# EAGLE design Adafruit PCM5122 I2S DAC (EAGLE 9.6.2)
COMPANY: ADAFRUIT INDUSTRIES; DRAWN: KTOWN; REV: A; YEAR: 2017
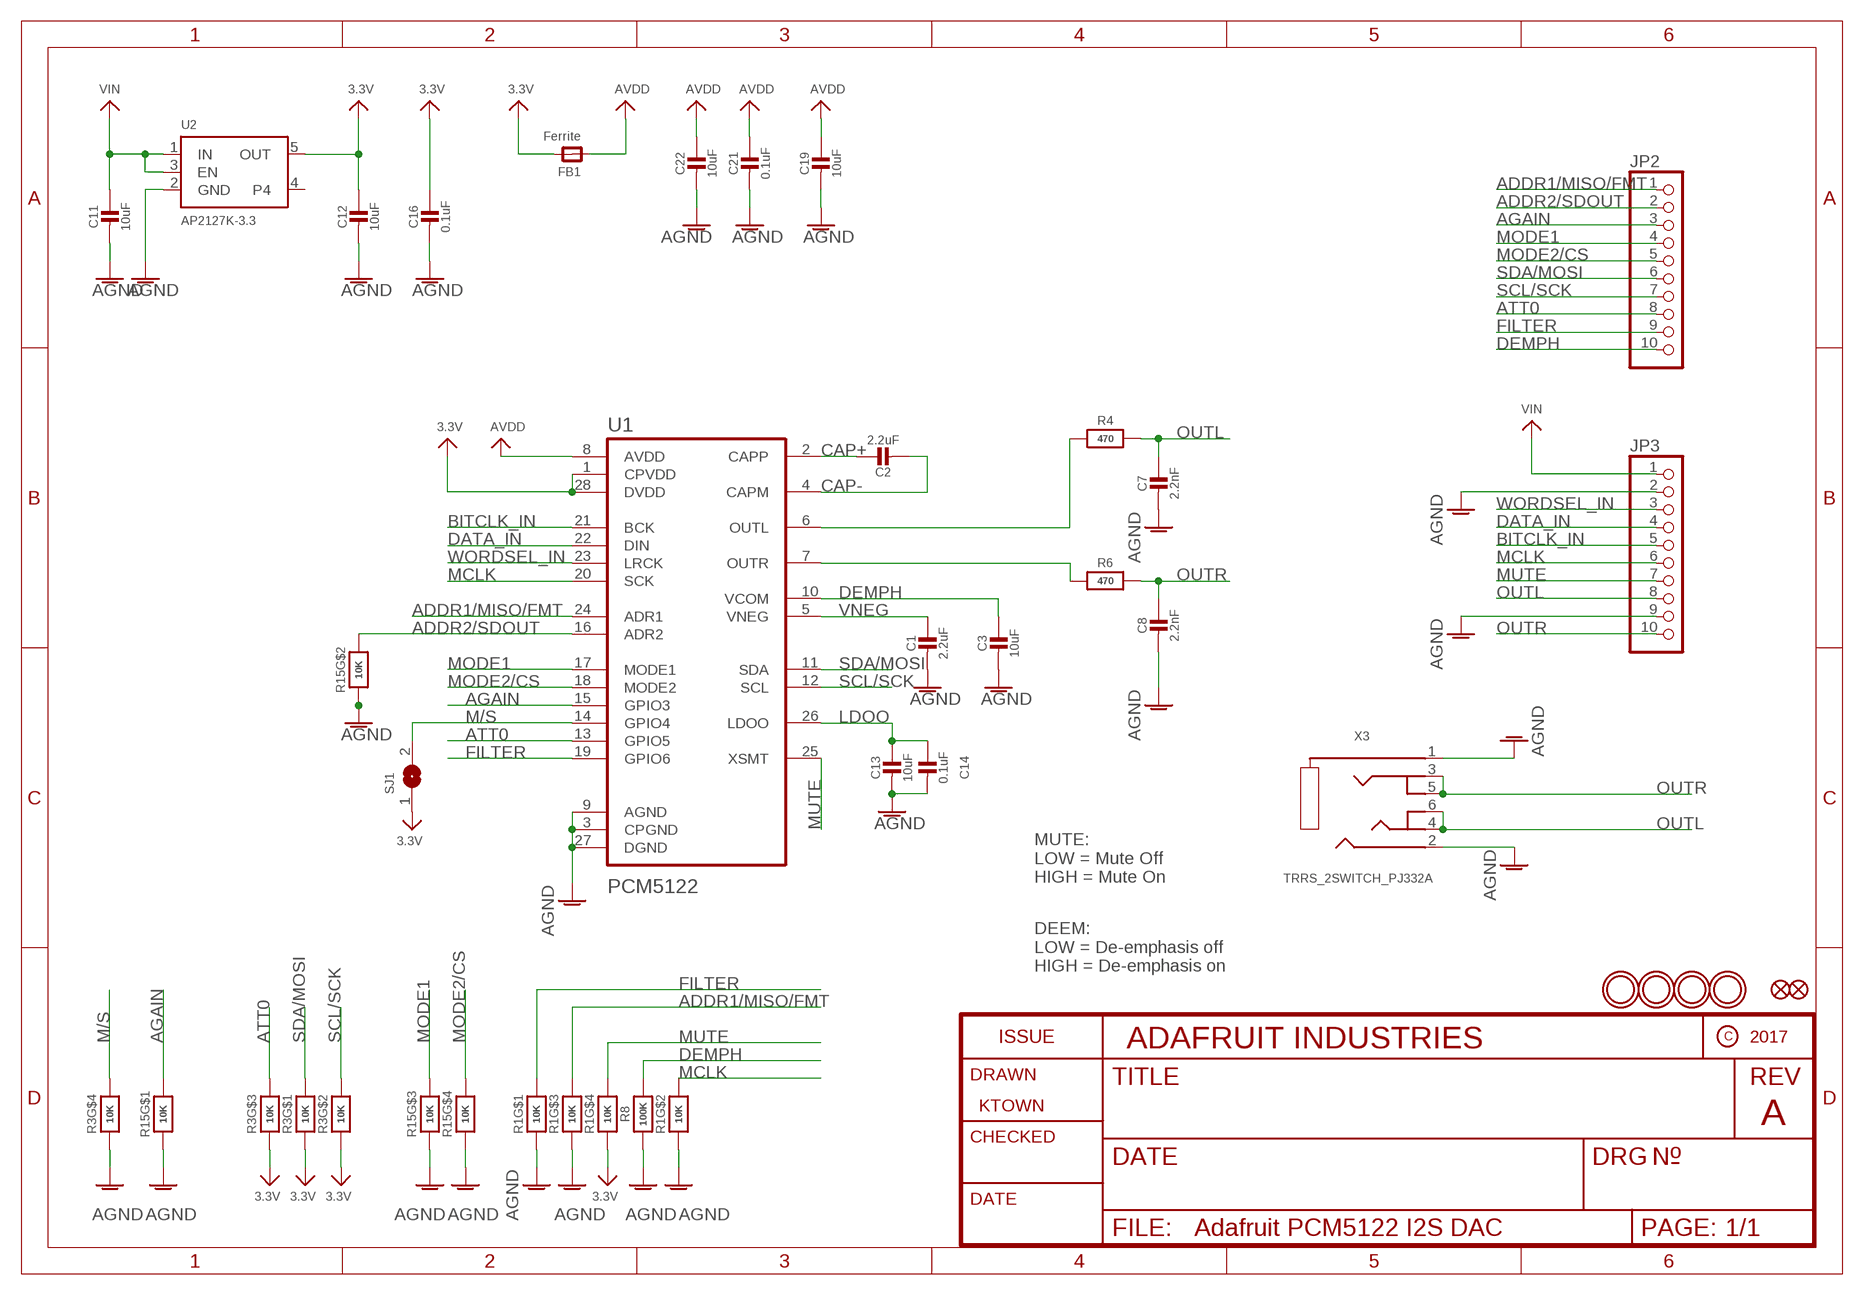
[diagram p0: schematic, sheet 1]

## Parts
C1  2.2uF  CAP_CERAMIC0603_NO  [0603-NO]
C2  2.2uF  CAP_CERAMIC0603_NO  [0603-NO]
C3  10uF  CAP_CERAMIC0805-NOOUTLINE  [0805-NO]
C7  2.2nF  CAP_CERAMIC0603_NO  [0603-NO]
C8  2.2nF  CAP_CERAMIC0603_NO  [0603-NO]
C11  10uF  CAP_CERAMIC0805-NOOUTLINE  [0805-NO]
C12  10uF  CAP_CERAMIC0805-NOOUTLINE  [0805-NO]
C13  10uF  CAP_CERAMIC0805-NOOUTLINE  [0805-NO]
C14  0.1uF  CAP_CERAMIC0603_NO  [0603-NO]
C16  0.1uF  CAP_CERAMIC0603_NO  [0603-NO]
C19  10uF  CAP_CERAMIC0805-NOOUTLINE  [0805-NO]
C21  0.1uF  CAP_CERAMIC0603_NO  [0603-NO]
C22  10uF  CAP_CERAMIC0805-NOOUTLINE  [0805-NO]
FB1  Ferrite  FERRITE-0603NO  [0603-NO]
FID1  FIDUCIAL_0.5MM  [FIDUCIAL_0.5MM]
FID2  FIDUCIAL_0.5MM  [FIDUCIAL_0.5MM]
JP2  HEADER-1X1070MIL  [1X10_ROUND70]
JP3  HEADER-1X1070MIL  [1X10_ROUND70]
R1  10K  RESISTOR_4PACK  [RESPACK_4X0603]
R3  10K  RESISTOR_4PACK  [RESPACK_4X0603]
R4  470  RESISTOR_0603_NOOUT  [0603-NO]
R6  470  RESISTOR_0603_NOOUT  [0603-NO]
R8  100K  RESISTOR_0603_NOOUT  [0603-NO]
R15  10K  RESISTOR_4PACK  [RESPACK_4X0603]
SJ1  SOLDERJUMPER  [SOLDERJUMPER_ARROW_NOPASTE]
U1  PCM5122  [SSOP-28N]
U2  AP2127K-3.3  VREG_SOT23-5  [SOT23-5]
U$11  MOUNTINGHOLE2.5  [MOUNTINGHOLE_2.5_PLATED]
U$12  MOUNTINGHOLE2.5  [MOUNTINGHOLE_2.5_PLATED]
U$13  MOUNTINGHOLE2.5  [MOUNTINGHOLE_2.5_PLATED]
U$14  MOUNTINGHOLE2.5  [MOUNTINGHOLE_2.5_PLATED]
X3  TRRS_2SWITCH_PJ332A  [PJ-332A]

## Nets
3.3V: C12.1 C16.1 FB1.2 R1.4 R3.1 R3.2 R3.3 SJ1.1 U1.1(CPVDD) U1.28(DVDD) U2.5(OUT)
ADDR1/MISO/FMT: JP2.1 R1.6 U1.24(ADR1)
ADDR2/SDOUT: JP2.2 R15.7 U1.16(ADR2)
AGAIN: JP2.3 R15.8 U1.15(GPIO3)
AGND: C1.2 C3.2 C7.2 C8.2 C11.2 C12.2 C13.2 C14.2 C16.2 C19.2 C21.2 C22.2 JP3.2 JP3.9 R1.1 R1.2 R1.3 R3.4 R8.1 R15.1 R15.2 R15.3 R15.4 U1.3(CPGND) U1.9(AGND) U1.27(DGND) U2.2(GND) X3.1(RING) X3.2(RING1)
ATT0: JP2.8 R3.6 U1.13(GPIO5)
AVDD: C19.1 C21.1 C22.1 FB1.1 U1.8(AVDD)
BITCLK_IN: JP3.5 U1.21(BCK)
CAP+: C2.1 U1.2(CAPP)
CAP-: C2.2 U1.4(CAPM)
DATA_IN: JP3.4 U1.22(DIN)
DEMPH: C3.1 JP2.10 R8.2 U1.10(VCOM)
FILTER: JP2.9 R1.8 U1.19(GPIO6)
LDOO: C13.1 C14.1 U1.26(LDOO)
M/S: R3.5 SJ1.2 U1.14(GPIO4)
MCLK: JP3.6 R1.7 U1.20(SCK)
MODE1: JP2.4 R15.6 U1.17(MODE1)
MODE2/CS: JP2.5 R15.5 U1.18(MODE2)
MUTE: JP3.7 R1.5 U1.25(XSMT)
N$1: R6.1 U1.7(OUTR)
N$2: R4.1 U1.6(OUTL)
OUTL: C7.1 JP3.8 R4.2 X3.4(TIP) X3.6(TIP_SW)
OUTR: C8.1 JP3.10 R6.2 X3.3(RING2) X3.5(R2_SW)
SCL/SCK: JP2.7 R3.7 U1.12(SCL)
SDA/MOSI: JP2.6 R3.8 U1.11(SDA)
VIN: C11.1 JP3.1 U2.1(IN) U2.3(EN)
VNEG: C1.1 U1.5(VNEG)
WORDSEL_IN: JP3.3 U1.23(LRCK)
Unconnected: U2.4

## Notes on the sheet
- MUTE:
  LOW = Mute Off
  HIGH = Mute On
- DEEM:
  LOW = De-emphasis off
  HIGH = De-emphasis on

## Library data of the parts
C1-C3 C7 C8 C11-C14 C16 C19 C21 C22 = microbuilder:CAP_CERAMIC: Ceramic Capacitors For new designs, use the packages preceded by an '_' character since they are more reliable: The following footprints should be used on most boards: _0402 - Standard footprint for regular board layouts _0603 - Standard footprint for regular board layouts _0805 - Standard footprint for regular board layouts _1206 - Standard footprint for regular board layouts For extremely tight-pitch boards where space is at a premium, the following 'micro-pitch' footprints can be used (smaller pads, no silkscreen outline, etc.): _0402MP - Micro-pitch footprint for very dense/compact boards _0603MP - Micro-pitch footprint for very dense/compact boards _0805MP - Micro-pitch footprint for very dense/compact boards _1206MP - Micro-pitch footprint for very dense/compact boards
FB1 = microbuilder:FERRITE: Ferrite Bead 0603 MMZ1608B121C - 120 Ohm @ 100MHz, 600mA, 0.15 Ohm DC Resistance - Digikey: 445-2164-1-ND BK1608HW121-T - 120 Ohm, 600mA Ferrite Chip - Digikey: 587-1876-2-ND 0805 HZ0805B272R-10 - 2.7K Ohm @ 100MHz, 200mA, 0.8 Ohm DC Resistance - Digikey: 240-2504-1-ND (see also Murata BLM21BD272SN1L) MMZ2012Y152B - 1.5K Ohm @ 100MHz, 500mA, 0.4 Ohm DC Resistance - Digikey: 445-1560-1-ND - Mainly for high frequency (80-400MHz) MMZ2012R102A - 1K Ohm @ 100MHz, 500mA, 0.3 Ohm DC Resistance - Digikey: 445-1555-2-ND - More general purpose (10-200MHz)
FID1 FID2 = microbuilder:FIDUCIAL: Fiducial Alignment Points Various fiducial points for machine vision alignment.
JP2 JP3 = microbuilder:HEADER-1X10: PIN HEADER
R1 R3 R15 = microbuilder:RESISTOR_4PACK: Resistor Packs (4 resistors) 4 x 0603 10K 1/16W - Digikey: YC164J-10KCT-ND
R4 R6 R8 = microbuilder:RESISTOR: Resistors For new designs, use the packages preceded by an '_' character since they are more reliable: The following footprints should be used on most boards: _0402 - Standard footprint for regular board layouts _0603 - Standard footprint for regular board layouts _0805 - Standard footprint for regular board layouts _1206 - Standard footprint for regular board layouts For extremely tight-pitch boards where space is at a premium, the following 'micro-pitch' footprints can be used (smaller pads, no silkscreen outline, etc.): _0402MP - Micro-pitch footprint for very dense/compact boards _0603MP - Micro-pitch footprint for very dense/compact boards _0805MP - Micro-pitch footprint for very dense/compact boards _1206MP - Micro-pitch footprint for very dense/compact boards
SJ1 = microbuilder:SOLDERJUMPER: SMD Solder JUMPER Solder the two pads together to create a connection, or remove the solder to break it. REFLOW - Use this footprint for solder paste and reflow ovens. WAVE - Use this footprint for hand-soldering (larger pads). CLOSED - Has a trace between the two pads to ensure it is closed by default. The trace needs to be cut to disable the jumper, and can be closed again by creating a solder bridge between the two pads.; BOM: EXCLUDE
U1 = microbuilder:PCM5122
U2 = adafruit_power:VREG_SOT23-5: SOT23-5 Fixed Voltage Regulators Part Current Out V Out V In V Dropout θJA (°C/W) TJ (°C) Digikey Part No. ADP121 150mA 3.3V 3.4-5.5V 0.09V @ 150mA -- -- ADP121-AUJZ33R7CT-ND ADP121 150mA 3.0V 3.1-5.5V 0.09V @ 150mA -- -- ADP121-AUJZ30R7CT-ND ADP122 300mA 3.3V 3.4-5.5V 0.085V @ 300mA -- -- ADP122AUJZ-3.3-R7CT-ND ADP1712 300mA 3.3V 3.5-5.5V 0.17V @ 300mA -- -- ADP1712AUJZ-3.3-R7TR-ND AP7311 (Low Cost) 150mA 3.3V 3.5-6V 0.15V @ 150mA -- -- AP7311-33WG-7DICT-ND LD39015M18R 150mA 1.8V 1.9V-5.5V 0.08V @ 100mA -- -- 497-6977-1-ND LP2985A-33DBVR 150mA 3.3V 3.3-16V 0.28V @ 150mA 206 150 296-18479-1-ND MCP1824T-3302E/OT 300mA 3.3V 3.5V-6V 0.2V @ 300mA -- -- MCP1824T-3302E/OTCT-ND MIC5205-2.5YM5 TR 150mA 2.5V 2.7-16V 0.165V @ 150mA -- -- 576-1257-2-ND MIC5205-3.0YM5 TR 150mA 3.0V 3.2V-16V 0.165V @ 150mA -- -- 576-1258-2-ND MIC5205-3.3YM5 TR 150mA 3.3V 3.5V-16V 0.165V @ 150mA -- -- 576-1259-2-ND TPS780330220 150mA 3.3V+2.2V 3.6-5.5V 250mV Max -- -- 296-23332-1-ND TDA3663/N1,135 100mA 3.3V 3.5-45V 0.18V @ 50mA -- -- 568-5343-1-ND Max operating temp can be calculated using θJA, TJ (max junction temperature), and power in watts. Set the "Maximum Ambient Temperature" until it reaches TJ ("Max Junction Temperature"), which is the absolute limit for safe use of the regulator: Heat Sink Temperature Calculator <http://www.daycounter.com/Calculators/Heat-Sink-Temperature-Calculator.phtml> For example, With 12V source into a 3.3V LP2985 and a 30mA load, we are dissipating (12V-3.3V) * 0.03A = 0.261W. With a θJA of 206 °C/W, a TJ of 150°C, and 261mW we can safely use the chip without a heat sink up to 75°C (=147.1°C Junction Temperature).; JLC_ROTATION: 270
U$11-U$14 = adafruit_electromech:MOUNTINGHOLE: Mounting Hole For #2 screws (0.086"/2.18mm width, 0.094"/2.4mm hole) use 2.5mm; BOM: EXCLUDE
X3 = adafruit_electromech:TRRS_2SWITCH

## Board
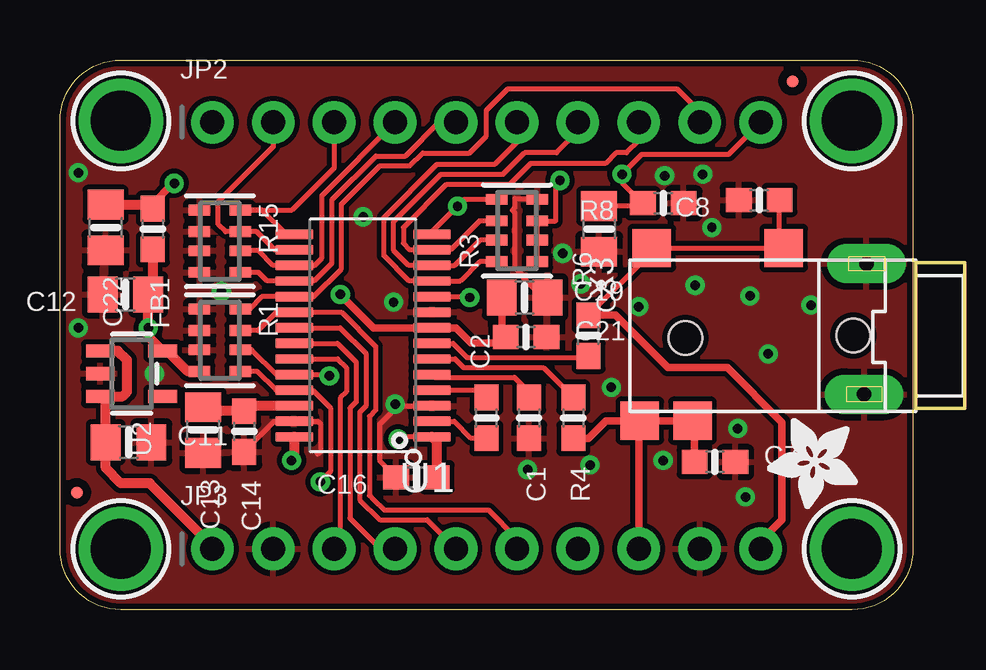
[diagram p1: board, top side]
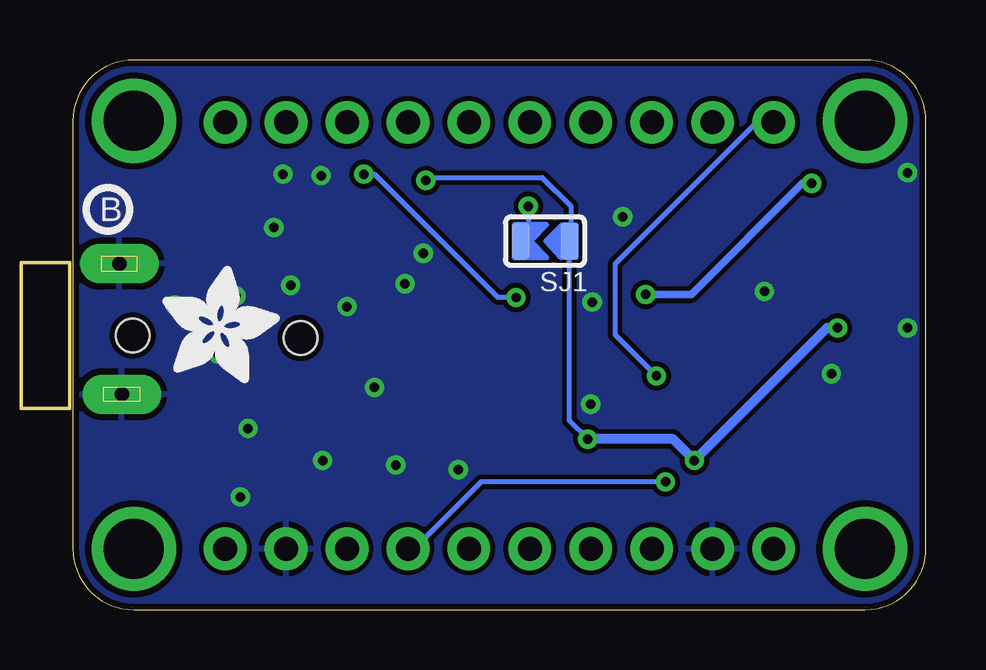
[diagram p2: board, bottom side, seen from below]

Size 35.56 x 22.92 mm. Coordinates in mm from the lower left corner, seen from the top.
Outline: 2.54,22.92 33.02,22.92 arc-90 35.56,20.38 35.56,2.54 arc-90 33.02,0 2.54,0 arc-90 0,2.54 0,20.38 arc-90 2.54,22.92
Copper layers (1*16): Top 0.035mm / dielectric 1.5mm / Bottom 0.035mm
Design rules "adafruit *": minimum track width 8mil, minimum drill 15.5mil, track to track 8mil, track to pad 8mil, pad to pad 8mil, via to via 8mil, smd to smd 8mil, copper to edge 10mil, drill to drill 8mil, minimum pad ring 10mil, minimum via ring 8mil, stop-mask expansion 2mil, vias tented up to drill 20mil, thermal gap 10mil

### Footprints (pad centres in the part's own frame; a part is rotated, then mirrored left to right if it is on the bottom)
0603-NO = smd 1.075 x 1: 1 -0.85,0; 2 0.85,0
0805-NO = smd 1.24 x 1.5: 1 -0.95,0; 2 0.95,0
FIDUCIAL_0.5MM = smd 0.5 x 0.5: 1 0,0
1X10_ROUND70 = drill 1 pad 1.778: 1 -11.43,0; 2 -8.89,0; 3 -6.35,0; 4 -3.81,0; 5 -1.27,0; 6 1.27,0; 7 3.81,0; 8 6.35,0; 9 8.89,0; 10 11.43,0
RESPACK_4X0603 = smd 0.45 x 0.9: 1 -1.3,-0.85; 2 -0.4,-0.85; 3 0.4,-0.85; 4 1.3,-0.85; 5 1.3,0.85; 6 0.4,0.85; 7 -0.4,0.85; 8 -1.3,0.85
SOLDERJUMPER_ARROW_NOPASTE = smd 0.762 x 1.524: 1 -1.016,0; 2 1.016,0
SSOP-28N = smd 1.57 x 0.41: 1 -2.87,4.225; 2 -2.87,3.575; 3 -2.87,2.925; 4 -2.87,2.275; 5 -2.87,1.625; 6 -2.87,0.975; 7 -2.87,0.325; 8 -2.87,-0.325; 9 -2.87,-0.975; 10 -2.87,-1.625; 11 -2.87,-2.275; 12 -2.87,-2.925; 13 -2.87,-3.575; 14 -2.87,-4.225; 15 2.87,-4.225; 16 2.87,-3.575; 17 2.87,-2.925; 18 2.87,-2.275; 19 2.87,-1.625; 20 2.87,-0.975; 21 2.87,-0.325; 22 2.87,0.325; 23 2.87,0.975; 24 2.87,1.625; 25 2.87,2.275; 26 2.87,2.925; 27 2.87,3.575; 28 2.87,4.225
SOT23-5 = smd 0.55 x 1.2: 1 -0.95,-1.3; 2 0,-1.3; 3 0.95,-1.3; 4 0.95,1.3; 5 -0.95,1.3
MOUNTINGHOLE_2.5_PLATED = drill 2.5 pad 3.2: P$1 0,0
PJ-332A = drill 0.6 pad 1.651 long: 1 -4.792,-3; 2 -4.692,2.45 | smd 1.6 x 1.6: 3 -1.342,-3.65; 4 2.458,3.55; 5 4.158,-3.65; 6 4.658,3.55 | hole 1.4: -4.242,0; 2.758,0.1

### Placement (x,y rotation side)
C1  19.56,8 270 top
C2  17.78,8 90 top
C3  22.48,15.88 270 top
C7  27.3,6.16 0 top
C8  29.15,17.08 180 top
C11  2.86,6.99 0 top
C12  2.73,13.14 180 top
C13  5.97,7.49 270 top
C14  7.68,7.43 270 top
C16  14.86,5.52 180 top
C19  19.37,13.02 0 top
C21  19.43,11.37 0 top
C22  1.91,15.94 270 top
FB1  3.87,15.88 270 top
FID1  30.54,22.03 0 top
FID2  0.7,4.89 0 top
JP2  17.78,20.32 0 top
JP3  17.78,2.54 0 top
PLABEL0  [PLABEL0]  29.15,0.95 0 top
PLABEL1  [PLABEL1]  24.19,0.95 0 top
PLABEL2  [PLABEL2]  6.35,4.13 0 top
PLABEL3  [PLABEL4]  26.67,4.25 0 top
PLABEL4  [PLABEL4]  8.89,0.95 0 top
PLABEL5  [PLABEL5]  16.51,4.19 0 top
PLABEL6  [PLABEL6]  11.43,4.19 0 top
PLABEL7  [PLABEL7]  14.03,0.89 0 top
PLABEL8  [PLABEL8]  18.99,0.95 0 top
PLABEL9  [PLABEL9]  26.67,21.97 0 top
PLABEL10  [PLABEL10]  29.34,18.54 0 top
PLABEL11  [PLABEL11]  24.13,18.54 0 top
PLABEL12  [PLABEL12]  21.72,21.97 0 top
PLABEL13  [PLABEL13]  19.3,18.67 0 top
PLABEL14  [PLABEL14]  16.64,21.97 0 top
PLABEL15  [PLABEL15]  13.97,18.67 0 top
PLABEL16  [PLABEL16]  11.43,21.97 0 top
PLABEL17  [PLABEL17]  6.48,22.1 0 top
PLABEL18  [PLABEL18]  8.89,18.67 0 top
PLABEL19  [PLABEL19]  6.48,18.67 0 top
PLABEL20  [PLABEL20]  21.72,4.19 0 top
PLABEL21  [PLABEL21]  12.45,17.14 0 top
PLABEL22  [PLABEL22]  35.18,16.76 0 top
PLABEL23  [PLABEL23]  17.91,17.91 0 bottom
PLABEL24  [PLABEL24]  15.49,9.14 0 bottom
PLABEL25  [PLABEL25]  13.97,15.37 0 bottom
R1  6.67,11.24 270 top
R3  19.05,15.81 90 top
R4  21.4,8 270 top
R6  22.03,11.43 90 top
R8  25.15,16.95 180 top
R15  6.67,15.37 270 top
SJ1  15.88,15.37 180 bottom
U1  12.64,11.43 180 top
U2  2.98,9.84 270 top
U$5  [PCBFEAT-REV-040]  34.1,16.7 0 bottom
U$6  [ADAFRUIT_5MM]  31.81,9.46 0 bottom
U$11  2.54,2.54 0 top
U$12  33.02,2.54 0 top
U$13  2.54,20.38 0 top
U$14  33.02,20.38 0 top
U$29  [ADAFRUIT_3.5MM]  33.27,8 180 top
X3  28.83,11.43 180 top

### Tracks (layer width: path | path; a pad name or v marks a point on that pad's centre or on a via)
3.3V  (via drill 0.39)
  Top 0.203: R3.1 R3.2 R3.3 20.66,16.21 20.66,17.72 v20.84,17.9 | v14.1,7.11 14.19,7.21 U1.1
  Top 0.406: FB1.2 3.87,13.34 C12.1 v3.68,11.75 3.68,11.4 U2.5 4.47,10.79 5.33,9.94 R1.4 | U1.28 9.77,6.34 v9.65,6.22 | C16.1 15.71,7 U1.1
  Bottom 0.203: v20.84,17.9 20.72,18.03 16,18.03 14.8,16.83 14.8,15.37 SJ1.1 14.86,7.87 v14.1,7.11
  Bottom 0.406: v3.68,11.75 4.13,11.75 v9.65,6.22 10.54,7.11 v14.1,7.11
ADDR1/MISO/FMT  (via drill 0.39)
  Top 0.203: R1.6 7.99,10.84 9.03,9.8 U1.24 11.18,9.8 v11.23,9.75
  Bottom 0.203: v11.23,9.75 12.95,11.47 12.95,14.41 7.05,20.32 JP2.1
ADDR2/SDOUT
  Top 0.203: U1.16 8.97,15.01 8.21,15.77 R15.7 6.9,15.77 6.6,16.07 6.6,17.02 8.89,19.3 JP2.2
AGAIN
  Top 0.203: U1.15 9.43,15.65 8.41,16.67 R15.8 9.68,16.67 11.43,18.42 JP2.3
AGND  (via drill 0.39)
  Top 0.203: C14.2 7.68,6.6 8.93,7.86 U1.27 10.75,7.86 10.86,7.75 10.86,6.6 10.73,6.48 | C16.2 13.34,6.2 13.34,7.75 14.09,8.51 U1.3 | R3.4 18.99,17.11 18.95,17.14 18.95,16.76 18.86,16.66 18.95,16.56 18.95,14.28 19.34,13.89 19.34,13.8 20.13,13.02 C19.2
  other vias: 13.91,12.83 13.97,8.57 19.49,5.84 21.72,13.59 20.95,14.86 25.21,18.1 26.8,18.16 26.48,13.53 24.13,12.64 31.31,12.7 28.77,13.08 29.53,10.67 22.99,9.27 28.26,7.56 22.1,6.03 25.15,6.22 28.57,4.7 12.64,16.38 3.94,9.84 0.76,11.75 0.76,18.22 6.73,13.27 27.18,15.94
  pour Bottom: 0,22.92 0,0 35.56,0 35.56,22.92
  pour Top: 0,22.92 0,0 35.56,0 35.56,22.92
ATT0
  Top 0.203: U1.13 15.88,15.01 16.27,15.01 17.48,16.21 R3.6 | JP2.8 24.13,19.56 23.62,19.05 23.18,19.05 22.73,18.61 19.62,18.61 18.74,17.72 16.09,17.72 14.31,15.94 14.31,15.28 14.59,15.01 U1.13 | U1.13
AVDD  (via drill 0.39)
  Top 0.203: v11.68,13.14 11.81,13.02
  Top 0.305: C19.1 18.42,11.53 C21.1 18.33,11.11 17.14,11.11 16.5,11.76 U1.8 13.07,11.76 11.81,13.02 | v4.76,17.78 4.73,17.78 3.84,16.89 3.77,16.82
  Top 0.406: C22.1 3.84,16.89 | 3.77,16.82 FB1.1
  Bottom 0.305: v11.68,13.14 9.78,13.14 5.14,17.78 v4.76,17.78
BITCLK_IN
  Top 0.203: U1.21 11.68,11.76 12.75,10.68 12.75,8.49 12.5,8.24 12.5,4.58 13.34,3.75 15.3,3.75 JP3.5
CAP+
  Top 0.203: U1.2 16.44,7.86 17.14,7.15 C2.1
CAP-
  Top 0.203: U1.4 17.48,9.15 C2.2
DATA_IN
  Top 0.203: U1.22 11.56,11.11 12.34,10.32 12.34,8.66 12.09,8.4 12.09,3.81 13.36,2.54 JP3.4
DEMPH  (via drill 0.39)
  Top 0.203: C3.1 24.17,16.82 R8.2 23.43,17.82 v23.43,18.16 24.26,18.99 27.88,18.99 JP2.10 | U1.10 17.04,13.05 v17.08,13.02
  Bottom 0.203: v17.08,13.02 17.84,13.02 22.99,18.16 v23.43,18.16
FILTER
  Top 0.203: R1.8 7.9,12.54 8.41,13.05 U1.19 10.58,13.05 11.73,14.21 11.73,16.91 13.34,18.52 14.58,18.52 15.12,19.05 17.08,19.05 17.78,19.75 17.78,20.83 18.67,21.72 25.72,21.72 26.67,20.77 JP2.9
LDOO
  Top 0.406: U1.26 7.68,8.51 C14.1 6.13,8.28 C13.1
M/S  (via drill 0.39)
  Top 0.203: R3.5 16.86,17.11 v16.57,16.83 15.51,15.76 U1.14
  Bottom 0.203: SJ1.2 16.57,15.68 v16.57,16.83
MCLK
  Top 0.203: R1.7 8.26,11.64 9.03,12.4 U1.20 11.73,12.4 13.16,10.98 13.16,8.32 12.9,8.07 12.9,4.76 13.06,4.61 13.07,4.61 13.53,4.15 17.86,4.15 19.05,2.96 JP3.6
MODE1
  Top 0.203: R15.6 8.27,14.97 8.89,14.36 U1.17 10.61,14.36 10.92,14.67 10.92,17.27 JP2.4
MODE2/CS
  Top 0.203: R15.5 8.28,14.07 8.64,13.71 U1.18 10.59,13.71 11.33,14.44 11.33,17.08 11.35,17.1 13.17,18.92 14.41,18.92 15.81,20.32 JP2.5
MUTE  (via drill 0.39)
  Top 0.203: R1.5 8.22,9.94 9,9.15 U1.25 10.53,9.15 11.28,8.41 11.28,5.76 v10.85,5.33
  Bottom 0.203: v10.85,5.33 18.54,5.33 21.34,2.54 JP3.7
N$1
  Top 0.203: U1.7 16.39,11.11 16.99,10.51 21.96,10.51 R6.1
N$2
  Top 0.203: U1.6 16.47,10.46 16.82,10.1 20.15,10.1 R4.1
OUTL
  Top 0.305: X3.6 24.13,7.88 JP3.8 | X3.6 X3.4 26.45,7.8 C7.1 | X3.6 22.76,7.88 22.04,7.15 R4.2
OUTR
  Top 0.203: R6.2 24.67,14.92 X3.5 X3.3 30,15.26 C8.1
  Top 0.305: JP3.10 28.89,2.54 30.1,3.75 30.1,7.81 27.81,10.1 25.34,10.1 23.15,12.28 R6.2
SCL/SCK
  Top 0.203: R3.7 17.51,15.41 16.45,14.36 U1.12 14.54,14.36 13.91,14.99 13.91,16.19 15.88,18.16 18.48,18.16 19.37,19.05 20.7,19.05 21.59,19.94 JP2.7
SDA/MOSI
  Top 0.203: R3.8 17.5,14.51 16.69,13.71 U1.11 14.55,13.71 13.5,14.76 13.5,16.36 15.71,18.57 18.13,18.57 19.05,19.49 JP2.6
VIN
  Top 0.406: JP3.1 6.35,2.67 3.75,5.27 2.54,5.27 1.91,5.9 C11.1 1.91,8.67 U2.3 2.61,8.89 2.79,9.08 2.79,10.41 2.42,10.79 U2.1
VNEG
  Top 0.203: U1.5 15.62,9.69 18.95,9.69 19.56,9.08 C1.1
WORDSEL_IN
  Top 0.203: U1.23 11.58,10.46 11.94,10.1 11.94,9.08 11.68,8.83 11.68,2.79 JP3.3

### Text on the board
Pinguin_tBackup: FMT | AGN | MOD2 | SCL | FILT | A1 | DE | A2 | FIL | MCK | MOD1 | MU | FM | SDA | 3V | ATT0 | DEEM | PCM5122 | Line / Out | PCM5100 | VIN | WSEL | BCK | G | MUTE | GND | DIN | Lout | Rout
Pinguin_bBackup: PCM5122 I2S DAC | PCM5122 I2S DAC | CLK Dir Sel | 100 dB 16/24/32-bit / Samprate: 8k-384kHz / I2S or LJ, MCLK-opt. | 112-dB 16/20/24/32-Bit / I2S, LJ, RJ, TDM/DSP / Hardware / I2C / SPI Control / 3.3V Logic, MCLK-optional / Line Out 1KΩ Min. Not AC-coupled | Line Out 1KΩ Load Min / Not AC-decoupled